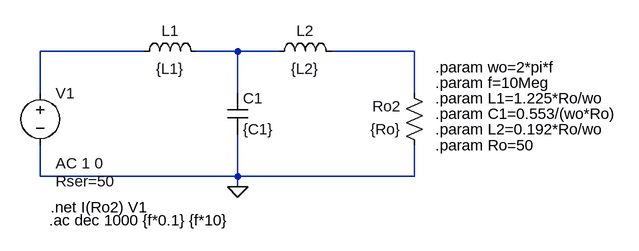
[diagram p0: schematic TS13.asc]
TS13.asc, the LTspice schematic file:
Version 4
SHEET 1 880 680
WIRE 96 96 -64 96
WIRE 240 96 176 96
WIRE 304 96 240 96
WIRE 512 96 384 96
WIRE -64 160 -64 96
WIRE 240 160 240 96
WIRE 512 160 512 96
WIRE -64 288 -64 240
WIRE 240 288 240 224
WIRE 240 288 -64 288
WIRE 512 288 512 240
WIRE 512 288 240 288
WIRE 240 304 240 288
FLAG 240 304 0
SYMBOL res 528 256 R180
WINDOW 0 36 76 Left 2
WINDOW 3 36 40 Left 2
SYMATTR InstName Ro2
SYMATTR Value {Ro}
SYMBOL cap 224 160 R0
SYMATTR InstName C1
SYMATTR Value {C1}
SYMBOL ind 80 112 R270
WINDOW 0 32 56 VTop 2
WINDOW 3 5 56 VBottom 2
SYMATTR InstName L1
SYMATTR Value {L1}
SYMBOL ind 288 112 R270
WINDOW 0 32 56 VTop 2
WINDOW 3 5 56 VBottom 2
SYMATTR InstName L2
SYMATTR Value {L2}
SYMBOL voltage -64 144 R0
WINDOW 123 24 124 Left 2
WINDOW 39 24 152 Left 2
SYMATTR InstName V1
SYMATTR Value ""
SYMATTR Value2 AC 1 0
SYMATTR SpiceLine Rser=50
TEXT -48 336 Left 2 !.net I(Ro2) V1
TEXT 544 120 Left 2 !.param wo=2*pi*f
TEXT 544 144 Left 2 !.param f=10Meg
TEXT 544 168 Left 2 !.param L1=1.225*Ro/wo
TEXT 544 192 Left 2 !.param C1=0.553/(wo*Ro)
TEXT 544 216 Left 2 !.param L2=0.192*Ro/wo
TEXT -50 356 Left 2 !.ac dec 1000 {f*0.1} {f*10}
TEXT 544 240 Left 2 !.param Ro=50

The netlist it stands for:
* TS13.asc
Ro2 0 N003 {Ro}
C1 N002 0 {C1}
L1 N001 N002 {L1}
L2 N002 N003 {L2}
V1 N001 0 AC 1 0 Rser=50
.net I(Ro2) V1
.param wo=2*pi*f
.param f=10Meg
.param L1=1.225*Ro/wo
.param C1=0.553/(wo*Ro)
.param L2=0.192*Ro/wo
.ac dec 1000 {f*0.1} {f*10}
.param Ro=50
.backanno
.end